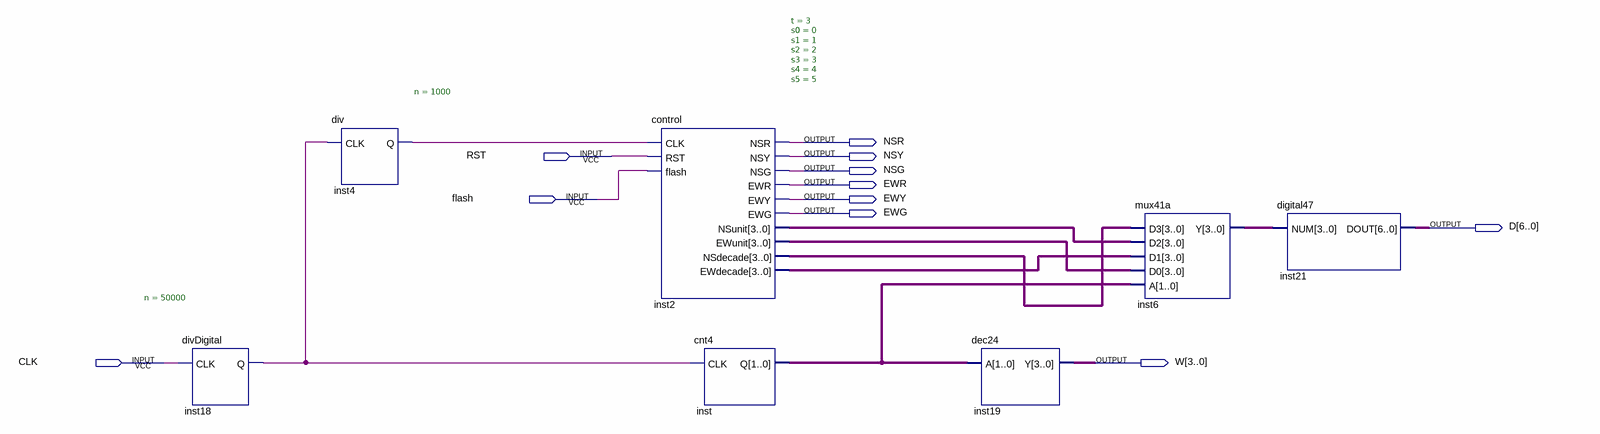
[diagram p0: schematic sheet]
// Quartus schematic fpga.bdf as structural Verilog: 7 symbols, 11 pins
module fpga (
  input  RST,
  input  flash,
  input  CLK,
  output NSR,
  output NSY,
  output NSG,
  output EWR,
  output EWY,
  output EWG,
  output [6:0] D,
  output [3:0] W
);

  wire inst4_q, inst18_q;
  wire [1:0] inst_q;
  wire [3:0] inst2_ewdecade, inst2_ewunit, inst2_nsdecade, inst2_nsunit, inst6_y;

  divDigital #(.n(50000)) inst18 (.CLK(CLK), .Q(inst18_q));
  div #(.n(1000)) inst4 (.CLK(inst18_q), .Q(inst4_q));
  control #(.t(3), .s0(0), .s1(1), .s2(2), .s3(3), .s4(4), .s5(5)) inst2 (
    .CLK(inst4_q), .RST(RST), .flash(flash), .NSR(NSR), .NSY(NSY), .NSG(NSG), .EWR(EWR), .EWY(EWY),
    .EWG(EWG), .NSunit(inst2_nsunit), .EWunit(inst2_ewunit), .NSdecade(inst2_nsdecade),
    .EWdecade(inst2_ewdecade));
  cnt4 inst (.CLK(inst18_q), .Q(inst_q));
  dec24 inst19 (.A(inst_q), .Y(W));
  mux41a inst6 (
    .D3(inst2_nsdecade), .D2(inst2_nsunit), .D1(inst2_ewdecade), .D0(inst2_ewunit), .A(inst_q), .Y(inst6_y));
  digital47 inst21 (.NUM(inst6_y), .DOUT(D));
endmodule
